# Altium schematic sheet 07 - ETH0-1000.SchDoc
size B; CompanyName: Microchip Technology Inc.; Organization: Microchip Technology; Address1: 2355 West Chandler Blvd.; Address2: Chandler, AZ  85224; Address4: USA; SheetNumber: 8; SheetTotal: 15; SheetTitle: ETH0-1000; Time: Time
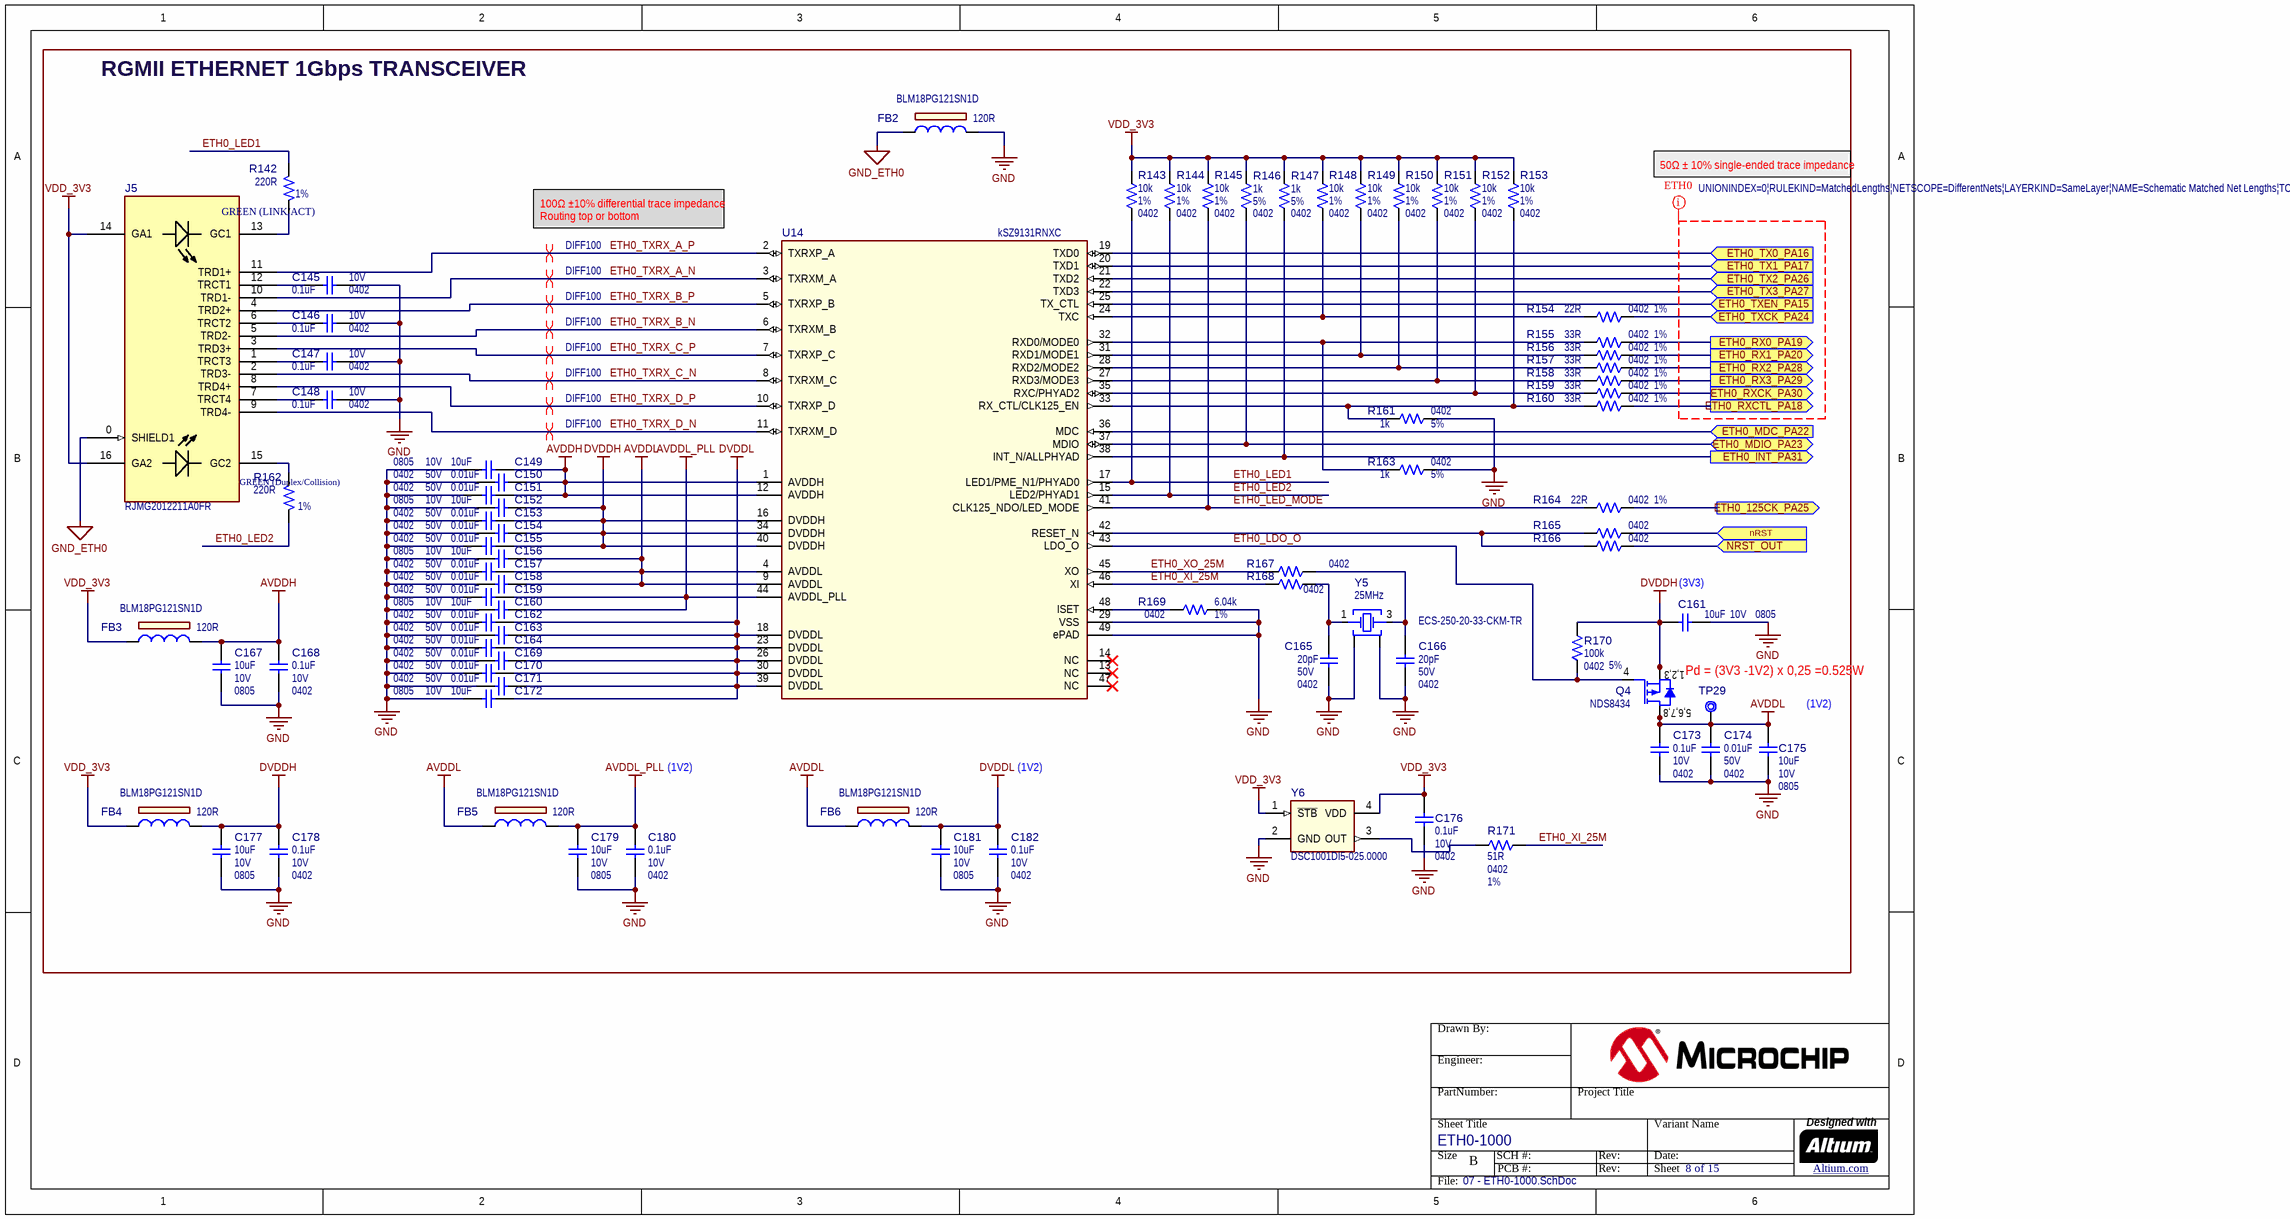
[diagram p0: 07 - ETH0-1000.SchDoc]

## Parts
?  (no value)  (graphical)
C145  value 0.1uF  Voltage: 10V  Package: 0402  [CAP_C_0402]  (hidden comment: Capacitor NP)
C146  value 0.1uF  Voltage: 10V  Package: 0402  [CAP_C_0402]  (hidden comment: Capacitor NP)
C147  value 0.1uF  Voltage: 10V  Package: 0402  [CAP_C_0402]  (hidden comment: Capacitor NP)
C148  value 0.1uF  Voltage: 10V  Package: 0402  [CAP_C_0402]  (hidden comment: Capacitor NP)
C149  value 10uF  Voltage: 10V  Package: 0805  [CAP_C_0805]  (hidden comment: Capacitor NP)
C150  value 0.01uF  Voltage: 50V  Package: 0402  [CAP_C_0402]  (hidden comment: Capacitor NP)
C151  value 0.01uF  Voltage: 50V  Package: 0402  [CAP_C_0402]  (hidden comment: Capacitor NP)
C152  value 10uF  Voltage: 10V  Package: 0805  [CAP_C_0805]  (hidden comment: Capacitor NP)
C153  value 0.01uF  Voltage: 50V  Package: 0402  [CAP_C_0402]  (hidden comment: Capacitor NP)
C154  value 0.01uF  Voltage: 50V  Package: 0402  [CAP_C_0402]  (hidden comment: Capacitor NP)
C155  value 0.01uF  Voltage: 50V  Package: 0402  [CAP_C_0402]  (hidden comment: Capacitor NP)
C156  value 10uF  Voltage: 10V  Package: 0805  [CAP_C_0805]  (hidden comment: Capacitor NP)
C157  value 0.01uF  Voltage: 50V  Package: 0402  [CAP_C_0402]  (hidden comment: Capacitor NP)
C158  value 0.01uF  Voltage: 50V  Package: 0402  [CAP_C_0402]  (hidden comment: Capacitor NP)
C159  value 0.01uF  Voltage: 50V  Package: 0402  [CAP_C_0402]  (hidden comment: Capacitor NP)
C160  value 10uF  Voltage: 10V  Package: 0805  [CAP_C_0805]  (hidden comment: Capacitor NP)
C161  value 10uF  Voltage: 10V  Package: 0805  [CAP_C_0805]  (hidden comment: Capacitor NP)
C162  value 0.01uF  Voltage: 50V  Package: 0402  [CAP_C_0402]  (hidden comment: Capacitor NP)
C163  value 0.01uF  Voltage: 50V  Package: 0402  [CAP_C_0402]  (hidden comment: Capacitor NP)
C164  value 0.01uF  Voltage: 50V  Package: 0402  [CAP_C_0402]  (hidden comment: Capacitor NP)
C165  value 20pF  Voltage: 50V  Package: 0402  [CAP_C_0402]  (hidden comment: Capacitor NP)
C166  value 20pF  Voltage: 50V  Package: 0402  [CAP_C_0402]  (hidden comment: Capacitor NP)
C167  value 10uF  Voltage: 10V  Package: 0805  [CAP_C_0805]  (hidden comment: Capacitor NP)
C168  value 0.1uF  Voltage: 10V  Package: 0402  [CAP_C_0402]  (hidden comment: Capacitor NP)
C169  value 0.01uF  Voltage: 50V  Package: 0402  [CAP_C_0402]  (hidden comment: Capacitor NP)
C170  value 0.01uF  Voltage: 50V  Package: 0402  [CAP_C_0402]  (hidden comment: Capacitor NP)
C171  value 0.01uF  Voltage: 50V  Package: 0402  [CAP_C_0402]  (hidden comment: Capacitor NP)
C172  value 10uF  Voltage: 10V  Package: 0805  [CAP_C_0805]  (hidden comment: Capacitor NP)
C173  value 0.1uF  Voltage: 10V  Package: 0402  [CAP_C_0402]  (hidden comment: Capacitor NP)
C174  value 0.01uF  Voltage: 50V  Package: 0402  [CAP_C_0402]  (hidden comment: Capacitor NP)
C175  value 10uF  Voltage: 10V  Package: 0805  [CAP_C_0805]  (hidden comment: Capacitor NP)
C176  value 0.1uF  Voltage: 10V  Package: 0402  [CAP_C_0402]  (hidden comment: Capacitor NP)
C177  value 10uF  Voltage: 10V  Package: 0805  [CAP_C_0805]  (hidden comment: Capacitor NP)
C178  value 0.1uF  Voltage: 10V  Package: 0402  [CAP_C_0402]  (hidden comment: Capacitor NP)
C179  value 10uF  Voltage: 10V  Package: 0805  [CAP_C_0805]  (hidden comment: Capacitor NP)
C180  value 0.1uF  Voltage: 10V  Package: 0402  [CAP_C_0402]  (hidden comment: Capacitor NP)
C181  value 10uF  Voltage: 10V  Package: 0805  [CAP_C_0805]  (hidden comment: Capacitor NP)
C182  value 0.1uF  Voltage: 10V  Package: 0402  [CAP_C_0402]  (hidden comment: Capacitor NP)
FB2  value 120R  Manufacturer Part Number 1: BLM18PG121SN1D  [IND_C_0603]  (hidden comment: Ferrite Bead)
FB3  value 120R  Manufacturer Part Number 1: BLM18PG121SN1D  [IND_C_0603]  (hidden comment: Ferrite Bead)
FB4  value 120R  Manufacturer Part Number 1: BLM18PG121SN1D  [IND_C_0603]  (hidden comment: Ferrite Bead)
FB5  value 120R  Manufacturer Part Number 1: BLM18PG121SN1D  [IND_C_0603]  (hidden comment: Ferrite Bead)
FB6  value 120R  Manufacturer Part Number 1: BLM18PG121SN1D  [IND_C_0603]  (hidden comment: Ferrite Bead)
J5  Manufacturer Part Number 1: RJMG2012211A0FR  [CON_JACK_RJ45_1PORT_LED_RJMG2012211A0FR]  (hidden comment: CON RJ-45 RJMG2012211A0FR)
Q4  value NDS8434  [SOIC-8]  (hidden comment: Transistor MOS-P SSSGDDDD)
R142  value 220R  Tolerance: 1%  [RES_C_0603]  (hidden comment: Resistor)
R143  value 10k  Package: 0402  Tolerance: 1%  [RES_C_0402]  (hidden comment: Resistor)
R144  value 10k  Package: 0402  Tolerance: 1%  [RES_C_0402]  (hidden comment: Resistor)
R145  value 10k  Package: 0402  Tolerance: 1%  [RES_C_0402]  (hidden comment: Resistor)
R146  value 1k  Package: 0402  Tolerance: 5%  [RES_C_0402]  (hidden comment: Resistor)
R147  value 1k  Package: 0402  Tolerance: 5%  [RES_C_0402]  (hidden comment: Resistor)
R148  value 10k  Package: 0402  Tolerance: 1%  [RES_C_0402]  (hidden comment: Resistor)
R149  value 10k  Package: 0402  Tolerance: 1%  [RES_C_0402]  (hidden comment: Resistor)
R150  value 10k  Package: 0402  Tolerance: 1%  [RES_C_0402]  (hidden comment: Resistor)
R151  value 10k  Package: 0402  Tolerance: 1%  [RES_C_0402]  (hidden comment: Resistor)
R152  value 10k  Package: 0402  Tolerance: 1%  [RES_C_0402]  (hidden comment: Resistor)
R153  value 10k  Package: 0402  Tolerance: 1%  [RES_C_0402]  (hidden comment: Resistor)
R154  value 22R  Package: 0402  Tolerance: 1%  [RES_C_0402]  (hidden comment: Resistor)
R155  value 33R  Package: 0402  Tolerance: 1%  [RES_C_0402]  (hidden comment: Resistor)
R156  value 33R  Package: 0402  Tolerance: 1%  [RES_C_0402]  (hidden comment: Resistor)
R157  value 33R  Package: 0402  Tolerance: 1%  [RES_C_0402]  (hidden comment: Resistor)
R158  value 33R  Package: 0402  Tolerance: 1%  [RES_C_0402]  (hidden comment: Resistor)
R159  value 33R  Package: 0402  Tolerance: 1%  [RES_C_0402]  (hidden comment: Resistor)
R160  value 33R  Package: 0402  Tolerance: 1%  [RES_C_0402]  (hidden comment: Resistor)
R161  value 1k  Package: 0402  Tolerance: 5%  [RES_C_0402]  (hidden comment: Resistor)
R162  value 220R  Tolerance: 1%  [RES_C_0603]  (hidden comment: Resistor)
R163  value 1k  Package: 0402  Tolerance: 5%  [RES_C_0402]  (hidden comment: Resistor)
R164  value 22R  Package: 0402  Tolerance: 1%  [RES_C_0402]  (hidden comment: Resistor)
R165  Package: 0402  [RES_C_0402]  (hidden comment: Resistor)
R166  Package: 0402  [RES_C_0402]  (hidden comment: Resistor)
R167  Package: 0402  [RES_C_0402]  (hidden comment: Resistor)
R168  Package: 0402  [RES_C_0402]  (hidden comment: Resistor)
R169  value 6.04k  Package: 0402  Tolerance: 1%  [RES_C_0402]  (hidden comment: Resistor)
R170  value 100k  Package: 0402  Tolerance: 5%  [RES_C_0402]  (hidden comment: Resistor)
R171  value 51R  Package: 0402  Tolerance: 1%  [RES_C_0402]  (hidden comment: Resistor)
TP29  Test Point No BOM  [TP_1mm_SMD]  (value not drawn)  (no BOM)
U14  Manufacturer Part Number 1: kSZ9131RNXC  [QFN-48_7x7_EP5.1x5.1]  (hidden comment: KSZ9131RNX QFN-48)
Y5  value 25MHz  Manufacturer Part Number 1: ECS-250-20-33-CKM-TR  [CRYSTAL_L3.2W2.5H0.8]  (hidden comment: Crystal 4 pins 1-3)
Y6  Manufacturer Part Number 1: DSC1001DI5-025.0000  [DFN-4_2.5x2]  (hidden comment: DSC10xx DFN-4)

## Blocks framed on the sheet
RGMII ETHERNET 1Gbps TRANSCEIVER: C145-C182 FB2-FB6 J5 Q4 R142-R171 TP29 U14 Y5 Y6

## Ports
ETH0_125CK_PA25 (out), ETH0_INT_PA31 (out), ETH0_MDC_PA22 (in), ETH0_MDIO_PA23 (bidir), ETH0_RX0_PA19 (out), ETH0_RX1_PA20 (out), ETH0_RX2_PA28 (out), ETH0_RX3_PA29 (out), ETH0_RXCK_PA30 (out), ETH0_RXCTL_PA18 (out), ETH0_TX0_PA16 (in), ETH0_TX1_PA17 (in), ETH0_TX2_PA26 (in), ETH0_TX3_PA27 (in), ETH0_TXCK_PA24 (in), ETH0_TXEN_PA15 (in), nRST (in), NRST_OUT (in)

## Nets
AVDDH: C149.1 C150.1 C151.1 C167.2 C168.2 FB3.2 U14.1(AVDDH) U14.12(AVDDH)
AVDDL: C156.1 C157.1 C158.1 C173.2 C174.2 C175.2 FB5.1 FB6.1 Q4.5(D) Q4.6(D) Q4.7(D) Q4.8(D) TP29.1 U14.4(AVDDL) U14.9(AVDDL)
AVDDL_PLL: C159.1 C160.1 C179.2 C180.2 FB5.2 U14.44(AVDDL_PLL)
DVDDH: C152.1 C153.1 C154.1 C155.1 C161.2 C177.2 C178.2 FB4.2 Q4.1(S) Q4.2(S) Q4.3(S) R170.2 U14.16(DVDDH) U14.34(DVDDH) U14.40(DVDDH)
DVDDL: C162.1 C163.1 C164.1 C169.1 C170.1 C171.1 C172.1 C181.2 C182.2 FB6.2 U14.18(DVDDL) U14.23(DVDDL) U14.26(DVDDL) U14.30(DVDDL) U14.39(DVDDL)
GND: C145.1 C146.1 C147.1 C148.1 C149.2 C150.2 C151.2 C152.2 C153.2 C154.2 C155.2 C156.2 C157.2 C158.2 C159.2 C160.2 C161.1 C162.2 C163.2 C164.2 C165.2 C166.2 C167.1 C168.1 C169.2 C170.2 C171.2 C172.2 C173.1 C174.1 C175.1 C176.1 C177.1 C178.1 C179.1 C180.1 C181.1 C182.1 FB2.2 R161.2 R163.2 R169.2 U14.29(VSS) U14.49(ePAD) Y5.2 Y5.4 Y6.2(GND)
GND_ETH0: FB2.1 J5.0(SHIELD1)
VDD_3V3: C176.2 FB3.1 FB4.1 J5.14(GA1) J5.16(GA2) R143.2 R144.2 R145.2 R146.2 R147.2 R148.2 R149.2 R150.2 R151.2 R152.2 R153.2 Y6.1(~{STB}) Y6.4(VDD)
ETH0_125CK_PA25: R164.2 ; port ETH0_125CK_PA25
ETH0_INT_PA31: R147.1 U14.38(INT_N/ALLPHYAD) ; port ETH0_INT_PA31
ETH0_LDO_O: Q4.4(G) R170.1 U14.43(LDO_O)
ETH0_LED1: R142.2 R143.1 U14.17(LED1/PME_N1/PHYAD0)
ETH0_LED2: R144.1 R162.2 U14.15(LED2/PHYAD1)
ETH0_LED_MODE: R145.1 R164.1 U14.41(CLK125_NDO/LED_MODE)
ETH0_MDC_PA22: U14.36(MDC) ; port ETH0_MDC_PA22
ETH0_MDIO_PA23: R146.1 U14.37(MDIO) ; port ETH0_MDIO_PA23
ETH0_RX0_PA19: R155.2 ; port ETH0_RX0_PA19
ETH0_RX1_PA20: R156.2 ; port ETH0_RX1_PA20
ETH0_RX2_PA28: R157.2 ; port ETH0_RX2_PA28
ETH0_RX3_PA29: R158.2 ; port ETH0_RX3_PA29
ETH0_RXCK_PA30: R159.2 ; port ETH0_RXCK_PA30
ETH0_RXCTL_PA18: R160.2 ; port ETH0_RXCTL_PA18
ETH0_TX0_PA16: U14.19(TXD0) ; port ETH0_TX0_PA16
ETH0_TX1_PA17: U14.20(TXD1) ; port ETH0_TX1_PA17
ETH0_TX2_PA26: U14.21(TXD2) ; port ETH0_TX2_PA26
ETH0_TX3_PA27: U14.22(TXD3) ; port ETH0_TX3_PA27
ETH0_TXCK_PA24: R154.2 ; port ETH0_TXCK_PA24
ETH0_TXEN_PA15: U14.25(TX_CTL) ; port ETH0_TXEN_PA15
ETH0_TXRX_A_N: J5.10(TRD1-) U14.3(TXRXM_A)
ETH0_TXRX_A_P: J5.11(TRD1+) U14.2(TXRXP_A)
ETH0_TXRX_B_N: J5.5(TRD2-) U14.6(TXRXM_B)
ETH0_TXRX_B_P: J5.4(TRD2+) U14.5(TXRXP_B)
ETH0_TXRX_C_N: J5.2(TRD3-) U14.8(TXRXM_C)
ETH0_TXRX_C_P: J5.3(TRD3+) U14.7(TXRXP_C)
ETH0_TXRX_D_N: J5.9(TRD4-) U14.11(TXRXM_D)
ETH0_TXRX_D_P: J5.8(TRD4+) U14.10(TXRXP_D)
ETH0_XI_25M: R168.2 R171.1 U14.46(XI)
ETH0_XO_25M: R167.2 U14.45(XO)
nRST: R165.1 ; port nRST
NRST_OUT: R166.1 ; port NRST_OUT
NetC145_2: C145.2 J5.12(TRCT1)
NetC146_2: C146.2 J5.6(TRCT2)
NetC147_2: C147.2 J5.1(TRCT3)
NetC148_2: C148.2 J5.7(TRCT4)
NetC165_1: C165.1 R168.1 Y5.1
NetC166_1: C166.1 R167.1 Y5.3
NetJ5_13: J5.13(GC1) R142.1
NetJ5_15: J5.15(GC2) R162.1
NetR148_1: R148.1 R154.1 U14.24(TXC)
NetR149_1: R149.1 R156.1 U14.31(RXD1/MODE1)
NetR150_1: R150.1 R157.1 U14.28(RXD2/MODE2)
NetR151_1: R151.1 R158.1 U14.27(RXD3/MODE3)
NetR152_1: R152.1 R159.1 U14.35(RXC/PHYAD2)
NetR153_1: R153.1 R160.1 R161.1 U14.33(RX_CTL/CLK125_EN)
NetR155_1: R155.1 R163.1 U14.32(RXD0/MODE0)
NetR165_2: R165.2 R166.2 U14.42(RESET_N)
NetR169_1: R169.1 U14.48(ISET)
NetR171_2: R171.2 Y6.3(OUT)

Not connected (* = marked no-connect by the designer): U14 13(NC)* 14(NC)* 47(NC)*

## Layout directives
net class ETH0; rule Matched Net Lengths [Tolerance = 0.25mm]: (no net found under the mark)
differential pair; differential pair class DIFF100; net class DIFF100; rule Matched Net Lengths [Tolerance = 4mil]: ETH0_TXRX_A_N, ETH0_TXRX_A_P, ETH0_TXRX_B_N, ETH0_TXRX_B_P, ETH0_TXRX_C_N, ETH0_TXRX_C_P, ETH0_TXRX_D_N, ETH0_TXRX_D_P

## Notes on the sheet
- 100Ω ±10% differential trace impedance
  Routing top or bottom
- 50Ω ± 10% single-ended trace impedance
- (near C161) (3V3)
- Pd = (3V3 -1V2) x 0,25 =0.525W
- (near C175) (1V2)
- (1V2)
- Drawn By:
- Engineer:
- PartNumber:
- Project Title
- Sheet Title
- Size
- B
- SCH #:
- PCB #:
- Rev:
- Variant Name
- Date:
- Sheet
- Designed with
- Altium.com <http://go.altium.com/MicrochipLandingPage_Evaluation.html>
- File:
- (in symbol CON1827) GREEN (LINK/ACT); GREEN (Duplex/Collision)
- (in symbol TRA1217) 1,2,3; 5,6,7,8

## Library data of the parts
? = Title Block B
C145-C148 C168 C173 C176 C178 C180 C182 = CAP1238: Capacitor; Manufacturer 1: KEMET; Manufacturer Part Number 1: C0402C104K8RACTU; Description_: CAP CER 0.1uF 10V 10% X7R SMD 0402; Dev Tools Status: Production; Tolerance: 10%; Temperature Coeffcient: X7R; Type: Ceramic; Owner: Tad Ahlvers; Populated: YES; MCHP-ID: CAP1238; Revision: 1; Symbol: Capacitor NP; Status: MCL Design; ComponentLink1URL: https://chn-vm-apps.microchip.com/mchprepo/parts/Datasheets/KEM_C1002_X7R_SMD.pdf; ComponentLink1Description: SVN Datasheet; ComponentLink2URL: C:\ALTIUM_WORK\00001_MCHP-CDB\Datasheets\KEM_C1002_X7R_SMD.pdf; ComponentLink2Description: Local Datasheet; ComponentLink3URL: C:\ALTIUM_WORK\00001_MCHP-CDB\Library\LibraryRefs\Capacitor NP.SchLib; ComponentLink3Description: Open Symbol; ComponentLink4URL: C:\ALTIUM_WORK\00001_MCHP-CDB\Library\Footprints\CAP_C_0402.PcbLib; ComponentLink4Description: Open Footprint; ComponentLink5Description: Open Footprint 2; ComponentLink6Description: Open Footprint 3; ComponentLink7Description: Open Footprint 4; Operating Temperature: -55C to +125C; Category: Capacitor; Manufacturer 2: Samsung; Manufacturer Part Number 2: CL05B104KP5NNNC; Manufacturer 3: Murata Electronics; Manufacturer Part Number 3: GRM155R71A104KA01D; Supplier 1: Digi-Key; Supplier Part Number 1: 399-3520-2-ND; Supplier 2: Digi-Key; Supplier Part Number 2: 1276-1002-2-ND; Supplier 3: Mouser; Supplier Part Number 3: 81-GRM155R71A104KA1D; Quantity Override: 1
C149 C152 C156 C160 C161 C172 C175 C179 C181 = CAP1148: Capacitor; Manufacturer 1: Samsung Electro-Mechanics America, Inc; Manufacturer Part Number 1: CL21B106KPQNFNE; Description_: CAP CER 10uF 10V 10% X7R SMD 0805; Dev Tools Status: Production; Tolerance: 10%; Temperature Coeffcient: X7R; Type: Ceramic; Owner: Mihai T(M91442); Populated: Yes; MCHP-ID: CAP1148; Revision: 0; Symbol: Capacitor NP; Status: MCL Design; ComponentLink1URL: https://chn-vm-apps.microchip.com/mchprepo/parts/Datasheets/L0005E.pdf; ComponentLink1Description: SVN Datasheet; ComponentLink2URL: C:\ALTIUM_WORK\00001_MCHP-CDB\Datasheets\L0005E.pdf; ComponentLink2Description: Local Datasheet; ComponentLink3URL: C:\ALTIUM_WORK\00001_MCHP-CDB\Library\LibraryRefs\Capacitor NP.SchLib; ComponentLink3Description: Open Symbol; ComponentLink4URL: C:\ALTIUM_WORK\00001_MCHP-CDB\Library\Footprints\CAP_C_0805.PcbLib; ComponentLink4Description: Open Footprint; ComponentLink5Description: Open Footprint 2; ComponentLink6Description: Open Footprint 3; ComponentLink7Description: Open Footprint 4; Operating Temperature: -55C to +125C; Category: Capacitor; Manufacturer 2: TDK Corporation; Manufacturer Part Number 2: C2012X7R1A106K125AC; Manufacturer 3: Murata; Manufacturer Part Number 3: GRM21BR71A106KE51L; Supplier 1: Digi-Key; Supplier Part Number 1: 1276-2934-1-ND; Supplier 2: Digi-Key; Supplier Part Number 2: 445-6857-1-ND; Supplier 3: Digi-Key; Supplier Part Number 3: 490-3905-1-ND; Supplier 4: Farnell; Supplier Part Number 4: 1828828; Quantity Override: 1
C150 C151 C153-C155 C157-C159 C162-C164 C169-C171 C174 = CAP2026: Capacitor; Manufacturer 1: TDK Corporation; Manufacturer Part Number 1: CGA2B3X7R1H103K050BB; Description_: CAP CER 0.01uF 50V 10% X7R SMD 0402; Dev Tools Status: Design; Tolerance: 10%; Temperature Coeffcient: X7R; Type: Ceramic; Owner: Gabor Bihari; Populated: YES; MCHP-ID: CAP2026; Revision: A; Symbol: Capacitor NP; Status: MCL Design; ComponentLink1URL: https://chn-vm-apps.microchip.com/mchprepo/parts/Datasheets/mlcc_automotive_general_en.pdf; ComponentLink1Description: SVN Datasheet; ComponentLink2URL: C:\ALTIUM_WORK\00001_MCHP-CDB\Datasheets\mlcc_automotive_general_en.pdf; ComponentLink2Description: Local Datasheet; ComponentLink3URL: C:\ALTIUM_WORK\00001_MCHP-CDB\Library\LibraryRefs\Capacitor NP.SchLib; ComponentLink3Description: Open Symbol; ComponentLink4URL: C:\ALTIUM_WORK\00001_MCHP-CDB\Library\Footprints\CAP_C_0402.PcbLib; ComponentLink4Description: Open Footprint; ComponentLink5Description: Open Footprint 2; ComponentLink6Description: Open Footprint 3; ComponentLink7Description: Open Footprint 4; Operating Temperature: -55C to +125C; Category: Capacitor; Supplier 1: Digi-Key; Supplier Part Number 1: 445-6893-1-ND; Quantity Override: 1
C165 C166 = CAP2438: Manufacturer 1: Samsung Electro-Mechanics; Manufacturer Part Number 1: CL05C200GB51PNC; Description_: Ceramic capacitor, SMD 0402, 20pF, C0G, 50V, +/-2%; Dev Tools Status: Design; Tolerance: 2%; Temperature Coeffcient: C0G; Type: Ceramic; Populated: DNP; Owner: Dragos Danaila; MCHP-ID: CAP2438; Revision: 1; Symbol: Capacitor NP; Status: MCL Design; ComponentLink1Description: SVN Datasheet; ComponentLink2Description: Local Datasheet; ComponentLink3URL: C:\ALTIUM_WORK\00001_MCHP-CDB\Library\LibraryRefs\Capacitor NP.SchLib; ComponentLink3Description: Open Symbol; ComponentLink4URL: C:\ALTIUM_WORK\00001_MCHP-CDB\Library\Footprints\CAP_C_0402.PcbLib; ComponentLink4Description: Open Footprint; ComponentLink5Description: Open Footprint 2; ComponentLink6Description: Open Footprint 3; ComponentLink7Description: Open Footprint 4; Operating Temperature: -55C to +125C; Category: Capacitor; Supplier 1: Digikey; Supplier Part Number 1: 1276-CL05C200GB51PNCTR-ND; Quantity Override: 1
C167 C177 = CAP1148: Capacitor; Manufacturer 1: Samsung Electro-Mechanics America, Inc; Manufacturer Part Number 1: CL21B106KPQNFNE; Description_: CAP CER 10uF 10V 10% X7R SMD 0805; Dev Tools Status: Production; Tolerance: 10%; Temperature Coeffcient: X7R; Type: Ceramic; Owner: Mihai T(M91442); Populated: DNP; MCHP-ID: CAP1148; Revision: 0; Symbol: Capacitor NP; Status: MCL Design; ComponentLink1URL: https://chn-vm-apps.microchip.com/mchprepo/parts/Datasheets/L0005E.pdf; ComponentLink1Description: SVN Datasheet; ComponentLink2URL: C:\ALTIUM_WORK\00001_MCHP-CDB\Datasheets\L0005E.pdf; ComponentLink2Description: Local Datasheet; ComponentLink3URL: C:\ALTIUM_WORK\00001_MCHP-CDB\Library\LibraryRefs\Capacitor NP.SchLib; ComponentLink3Description: Open Symbol; ComponentLink4URL: C:\ALTIUM_WORK\00001_MCHP-CDB\Library\Footprints\CAP_C_0805.PcbLib; ComponentLink4Description: Open Footprint; ComponentLink5Description: Open Footprint 2; ComponentLink6Description: Open Footprint 3; ComponentLink7Description: Open Footprint 4; Operating Temperature: -55C to +125C; Category: Capacitor; Manufacturer 2: TDK Corporation; Manufacturer Part Number 2: C2012X7R1A106K125AC; Manufacturer 3: Murata; Manufacturer Part Number 3: GRM21BR71A106KE51L; Supplier 1: Digi-Key; Supplier Part Number 1: 1276-2934-1-ND; Supplier 2: Digi-Key; Supplier Part Number 2: 445-6857-1-ND; Supplier 3: Digi-Key; Supplier Part Number 3: 490-3905-1-ND; Supplier 4: Farnell; Supplier Part Number 4: 1828828; Quantity Override: 1
FB2-FB6 = IND1009: Manufacturer 1: Murata; Description_: FERRITE 120R@100MHz 2A SMD 0603; Dev Tools Status: Production; Owner: Petnarong Chaijaroong; DCR: 0.05R; Saturation Current: 12A; Populated: Yes; MCHP-ID: IND1009; Revision: 0; Symbol: Ferrite Bead; Status: MCL Design; ComponentLink1URL: https://chn-vm-apps.microchip.com/mchprepo/parts/Datasheets/L0110S0100BLM18P.pdf; ComponentLink1Description: SVN Datasheet; ComponentLink2URL: C:\ALTIUM_WORK\00001_MCHP-CDB\Datasheets\L0110S0100BLM18P.pdf; ComponentLink2Description: Local Datasheet; ComponentLink3URL: C:\ALTIUM_WORK\00001_MCHP-CDB\Library\LibraryRefs\Ferrite Bead.SchLib; ComponentLink3Description: Open Symbol; ComponentLink4URL: C:\ALTIUM_WORK\00001_MCHP-CDB\Library\Footprints\IND_C_0603.PcbLib; ComponentLink4Description: Open Footprint; ComponentLink5Description: Open Footprint 2; ComponentLink6Description: Open Footprint 3; ComponentLink7Description: Open Footprint 4; Operating Temperature: -55C to +125C; Package: 0603; Type: Ferrite Bead; Category: Inductor; Supplier 1: Digi-Key; Supplier Part Number 1: 490-1037-1-ND; Quantity Override: 1
J5 = CON1827: Manufacturer 1: Amphenol Commercial Products; Value: MODULAR RJ45; Description_: CON MODULAR JACK RJ45 10/100/1000 MAGNETICS 2xLEDs SHIELD TH R/A; Dev Tools Status: Production; Owner: Jennifer Hancock; Populated: YES; MCHP-ID: CON1827; Revision: 1; Symbol: CON RJ-45 RJMG2012211A0FR; Status: MCL Design; ComponentLink1URL: https://chn-vm-apps.microchip.com/mchprepo/parts/Datasheets/RJMG2012211A0FR-RJ45MagjackwLED; ComponentLink1Description: SVN Datasheet; ComponentLink2URL: C:\ALTIUM_WORK\00001_MCHP-CDB\Datasheets\RJMG2012211A0FR-RJ45MagjackwLED; ComponentLink2Description: Local Datasheet; ComponentLink3URL: C:\ALTIUM_WORK\00001_MCHP-CDB\Library\LibraryRefs\CON RJ-45 RJMG2012211A0FR.SchLib; ComponentLink3Description: Open Symbol; ComponentLink4URL: C:\ALTIUM_WORK\00001_MCHP-CDB\Library\Footprints\CON_JACK_RJ45_1PORT_LED_RJMG2012211A0FR.PcbLib; ComponentLink4Description: Open Footprint; ComponentLink5Description: Open Footprint 2; ComponentLink6Description: Open Footprint 3; ComponentLink7Description: Open Footprint 4; Type: Modular; Category: Connector; Supplier 1: Digi-Key; Supplier Part Number 1: RJMG2012211A0FR-ND; Quantity Override: 1
Q4 = TRA1217: Transistor MOS; Manufacturer 1: ON Semiconductor; Description_: TRANS FET P-CH NDS8434 20V 6.5A 2.5W SOIC-8; Dev Tools Status: Design; Type: FET; Current: 6.5A; Drain to Source Voltage: 20V; Gate to Source Voltage: 8V; Power: 2.5W; Owner: Cristian Papuc; Populated: YES; MCHP-ID: TRA1217; Revision: A; Symbol: Transistor MOS-P SSSGDDDD; Status: MCL Design; Package: SOIC-8; ComponentLink1URL: https://chn-vm-apps.microchip.com/mchprepo/parts/Datasheets/NDS8425.pdf; ComponentLink1Description: SVN Datasheet; ComponentLink2URL: C:\ALTIUM_WORK\00001_MCHP-CDB\Datasheets\NDS8425.pdf; ComponentLink2Description: Local Datasheet; ComponentLink3URL: C:\ALTIUM_WORK\00001_MCHP-CDB\Library\LibraryRefs\Transistor MOS-P SSSGDDDD.SchLib; ComponentLink3Description: Open Symbol; ComponentLink4URL: C:\ALTIUM_WORK\00001_MCHP-CDB\Library\Footprints\SOIC-8.PcbLib; ComponentLink4Description: Open Footprint; ComponentLink5Description: Open Footprint 2; ComponentLink6Description: Open Footprint 3; ComponentLink7Description: Open Footprint 4; Operating Temperature: -55C to +150C; Category: Transistor; Voltage: 20V; Manufacturer Part Number 1: NDS8434; Supplier 1: Digi-Key; Supplier Part Number 1: NDS8434CT-ND; Quantity Override: 1
R142 R162 = RSMT1296: Manufacturer 1: Stackpole Electronics Inc; Manufacturer Part Number 1: RMCF0603FT220R; Description_: RES TKF 220R 1% 1/10W SMD 0603; Dev Tools Status: Design; Voltage: 75V; Temperature Coeffcient: 100ppm/C; Power: 1/10W; Owner: Dragos Danaila; Populated: YES; MCHP-ID: RSMT1296; Revision: 1; Symbol: Resistor; Status: MCL Design; ComponentLink1URL: https://chn-vm-apps.microchip.com/mchprepo/parts/Datasheets/sei-rmcf_rmcp.pdf; ComponentLink1Description: SVN Datasheet; ComponentLink2URL: C:\ALTIUM_WORK\00001_MCHP-CDB\Datasheets\sei-rmcf_rmcp.pdf; ComponentLink2Description: Local Datasheet; ComponentLink3URL: C:\ALTIUM_WORK\00001_MCHP-CDB\Library\LibraryRefs\Resistor.SchLib; ComponentLink3Description: Open Symbol; ComponentLink4URL: C:\ALTIUM_WORK\00001_MCHP-CDB\Library\Footprints\RES_C_0603.PcbLib; ComponentLink4Description: Open Footprint; ComponentLink5Description: Open Footprint 2; ComponentLink6Description: Open Footprint 3; ComponentLink7Description: Open Footprint 4; Operating Temperature: -55C to +155C; Category: Resistor; Type: RES SMD; Composition: TKF; Supplier 1: Digikey; Supplier Part Number 1: RMCF0603FT220RCT-ND; Quantity Override: 1
R143-R145 R149-R152 = RSMT1019: Manufacturer 1: Panasonic; Manufacturer Part Number 1: ERJ-2RKF1002X; Description_: RES TKF 10k 1% 1/10W SMD 0402; Dev Tools Status: Production; Voltage: 50V; Temperature Coeffcient: 100ppm/C; Power: 1/10W; Owner: Brent Lanphear; Populated: Yes; MCHP-ID: RSMT1019; Revision: 2; Symbol: Resistor; Status: MCL Design; ComponentLink1URL: https://chn-vm-apps.microchip.com/mchprepo/parts/Datasheets/AOA0000CE2.pdf; ComponentLink1Description: SVN Datasheet; ComponentLink2URL: C:\ALTIUM_WORK\00001_MCHP-CDB\Datasheets\AOA0000CE2.pdf; ComponentLink2Description: Local Datasheet; ComponentLink3URL: C:\ALTIUM_WORK\00001_MCHP-CDB\Library\LibraryRefs\Resistor.SchLib; ComponentLink3Description: Open Symbol; ComponentLink4URL: C:\ALTIUM_WORK\00001_MCHP-CDB\Library\Footprints\RES_C_0402.PcbLib; ComponentLink4Description: Open Footprint; ComponentLink5Description: Open Footprint 2; ComponentLink6Description: Open Footprint 3; ComponentLink7Description: Open Footprint 4; Operating Temperature: -55C to +155C; Category: Resistor; Type: RES SMD; Composition: TKF; Supplier 1: Digi-Key; Supplier Part Number 1: P10.0KLCT-ND; Quantity Override: 1
R146 R147 R161 R163 = RSMT0316: Manufacturer 1: Panasonic; Manufacturer Part Number 1: ERJ-2GEJ102X; Description_: RES TKF 1k 5% 1/16W SMD 0402; Dev Tools Status: Production; Voltage: 50V; Temperature Coeffcient: 200ppm/C; Power: 1/16W; Owner: Tad Ahlvers; Populated: YES; MCHP-ID: RSMT0316; Revision: 1; Symbol: Resistor; Status: MCL Design; ComponentLink1URL: https://chn-vm-apps.microchip.com/mchprepo/parts/Datasheets/AOA0000CE1.pdf; ComponentLink1Description: SVN Datasheet; ComponentLink2URL: C:\ALTIUM_WORK\00001_MCHP-CDB\Datasheets\AOA0000CE1.pdf; ComponentLink2Description: Local Datasheet; ComponentLink3URL: C:\ALTIUM_WORK\00001_MCHP-CDB\Library\LibraryRefs\Resistor.SchLib; ComponentLink3Description: Open Symbol; ComponentLink4URL: C:\ALTIUM_WORK\00001_MCHP-CDB\Library\Footprints\RES_C_0402.PcbLib; ComponentLink4Description: Open Footprint; ComponentLink5Description: Open Footprint 2; ComponentLink6Description: Open Footprint 3; ComponentLink7Description: Open Footprint 4; Operating Temperature: -55C to +155C; Category: Resistor; Type: RES SMD; Composition: TKF; Supplier 1: Digi-Key; Supplier Part Number 1: P1.0KJCT-ND; Quantity Override: 1
R148 R153 = RSMT1019: Manufacturer 1: Panasonic; Manufacturer Part Number 1: ERJ-2RKF1002X; Description_: RES TKF 10k 1% 1/10W SMD 0402; Dev Tools Status: Production; Voltage: 50V; Temperature Coeffcient: 100ppm/C; Power: 1/10W; Owner: Brent Lanphear; Populated: DNP; MCHP-ID: RSMT1019; Revision: 2; Symbol: Resistor; Status: MCL Design; ComponentLink1URL: https://chn-vm-apps.microchip.com/mchprepo/parts/Datasheets/AOA0000CE2.pdf; ComponentLink1Description: SVN Datasheet; ComponentLink2URL: C:\ALTIUM_WORK\00001_MCHP-CDB\Datasheets\AOA0000CE2.pdf; ComponentLink2Description: Local Datasheet; ComponentLink3URL: C:\ALTIUM_WORK\00001_MCHP-CDB\Library\LibraryRefs\Resistor.SchLib; ComponentLink3Description: Open Symbol; ComponentLink4URL: C:\ALTIUM_WORK\00001_MCHP-CDB\Library\Footprints\RES_C_0402.PcbLib; ComponentLink4Description: Open Footprint; ComponentLink5Description: Open Footprint 2; ComponentLink6Description: Open Footprint 3; ComponentLink7Description: Open Footprint 4; Operating Temperature: -55C to +155C; Category: Resistor; Type: RES SMD; Composition: TKF; Supplier 1: Digi-Key; Supplier Part Number 1: P10.0KLCT-ND; Quantity Override: 1
R154 = RES1474: Manufacturer 1: Panasonic Electronic Components; Manufacturer Part Number 1: ERJ-2RKF22R0X; Description_: RES TKF 22R 1% 1/20W SMD 0402; Dev Tools Status: Production; Temperature Coeffcient: 100ppm/C; Circuit Type: Isolated; Power: 1/10W; Owner: Mike Ragsdale; Populated: YES; MCHP-ID: RES1474; Revision: 1; Symbol: Resistor; Status: MCL Design; ComponentLink1Description: SVN Datasheet; ComponentLink2Description: Local Datasheet; ComponentLink3URL: C:\ALTIUM_WORK\00001_MCHP-CDB\Library\LibraryRefs\Resistor.SchLib; ComponentLink3Description: Open Symbol; ComponentLink4URL: C:\ALTIUM_WORK\00001_MCHP-CDB\Library\Footprints\RES_C_0402.PcbLib; ComponentLink4Description: Open Footprint; ComponentLink5Description: Open Footprint 2; ComponentLink6Description: Open Footprint 3; ComponentLink7Description: Open Footprint 4; Operating Temperature: -55C to +155C; Category: Resistor; Type: RES SMD; Composition: TKF; Supplier 1: Digi-Key; Supplier Part Number 1: P22.0LCT-ND; Quantity Override: 1
R155-R160 = RES1552: Manufacturer 1: Panasonic Electronic Components; Manufacturer Part Number 1: ERJ-2RKF33R0X; Description_: RES TKF 33R 1% 1/10W SMD 0402; Dev Tools Status: Production; Temperature Coeffcient: 100ppm/C; Power: 1/10W; Owner: Sorin Stanoaia; Populated: YES; MCHP-ID: RES1552; Revision: 1; Symbol: Resistor; Status: MCL Design; ComponentLink1Description: SVN Datasheet; ComponentLink2Description: Local Datasheet; ComponentLink3URL: C:\ALTIUM_WORK\00001_MCHP-CDB\Library\LibraryRefs\Resistor.SchLib; ComponentLink3Description: Open Symbol; ComponentLink4URL: C:\ALTIUM_WORK\00001_MCHP-CDB\Library\Footprints\RES_C_0402.PcbLib; ComponentLink4Description: Open Footprint; ComponentLink5Description: Open Footprint 2; ComponentLink6Description: Open Footprint 3; ComponentLink7Description: Open Footprint 4; Operating Temperature: -55C to +155C; Category: Resistor; Type: RES SMD; Composition: TKF; Supplier 1: Digi-Key; Supplier Part Number 1: P33.0LCT-ND; Quantity Override: 1; ComponentLink1URL: https://chn-vm-apps.microchip.com/mchprepo/parts/Datasheets/AOA0000CE2.pdf; ComponentLink2URL: C:\ALTIUM_WORK\00001_MCHP-CDB\Datasheets\AOA0000CE2.pdf
R164 = RES1474: Manufacturer 1: Panasonic Electronic Components; Manufacturer Part Number 1: ERJ-2RKF22R0X; Description_: RES TKF 22R 1% 1/20W SMD 0402; Dev Tools Status: Production; Temperature Coeffcient: 100ppm/C; Circuit Type: Isolated; Power: 1/10W; Owner: Mike Ragsdale; Populated: DNP; MCHP-ID: RES1474; Revision: 1; Symbol: Resistor; Status: MCL Design; ComponentLink1Description: SVN Datasheet; ComponentLink2Description: Local Datasheet; ComponentLink3URL: C:\ALTIUM_WORK\00001_MCHP-CDB\Library\LibraryRefs\Resistor.SchLib; ComponentLink3Description: Open Symbol; ComponentLink4URL: C:\ALTIUM_WORK\00001_MCHP-CDB\Library\Footprints\RES_C_0402.PcbLib; ComponentLink4Description: Open Footprint; ComponentLink5Description: Open Footprint 2; ComponentLink6Description: Open Footprint 3; ComponentLink7Description: Open Footprint 4; Operating Temperature: -55C to +155C; Category: Resistor; Type: RES SMD; Composition: TKF; Supplier 1: Digi-Key; Supplier Part Number 1: P22.0LCT-ND; Quantity Override: 1
R165 R167 R168 = RES2693: Manufacturer 1: Bourns Inc.; Manufacturer Part Number 1: CR0402-J/-000GLF; Description_: RES TKF 0R 1/16W SMD 0402; Dev Tools Status: Design; Power: 1/16W; Populated: DNP; Owner: Dragos Danaila; Voltage: 50V; Temperature Coeffcient: 100ppm/C; Current: 1A; MCHP-ID: RES2693; Revision: 1; Symbol: Resistor; Status: MCL Design; ComponentLink1URL: https://chn-vm-apps.microchip.com/mchprepo/parts/Datasheets/crxxxxx.pdf; ComponentLink1Description: SVN Datasheet; ComponentLink2URL: C:\ALTIUM_WORK\00001_MCHP-CDB\Datasheets\crxxxxx.pdf; ComponentLink2Description: Local Datasheet; ComponentLink3URL: C:\ALTIUM_WORK\00001_MCHP-CDB\Library\LibraryRefs\Resistor.SchLib; ComponentLink3Description: Open Symbol; ComponentLink4URL: C:\ALTIUM_WORK\00001_MCHP-CDB\Library\Footprints\RES_C_0402.PcbLib; ComponentLink4Description: Open Footprint; ComponentLink5Description: Open Footprint 2; ComponentLink6Description: Open Footprint 3; ComponentLink7Description: Open Footprint 4; Operating Temperature: -55C to +155C; Category: Resistor; Type: RES SMD; Composition: TKF; Supplier 1: Digikey; Supplier Part Number 1: CR0402-J/-000GLFTR-ND; Quantity Override: 1
R166 = RES2693: Manufacturer 1: Bourns Inc.; Manufacturer Part Number 1: CR0402-J/-000GLF; Description_: RES TKF 0R 1/16W SMD 0402; Dev Tools Status: Design; Power: 1/16W; Populated: YES; Owner: Dragos Danaila; Voltage: 50V; Temperature Coeffcient: 100ppm/C; Current: 1A; MCHP-ID: RES2693; Revision: 1; Symbol: Resistor; Status: MCL Design; ComponentLink1URL: https://chn-vm-apps.microchip.com/mchprepo/parts/Datasheets/crxxxxx.pdf; ComponentLink1Description: SVN Datasheet; ComponentLink2URL: C:\ALTIUM_WORK\00001_MCHP-CDB\Datasheets\crxxxxx.pdf; ComponentLink2Description: Local Datasheet; ComponentLink3URL: C:\ALTIUM_WORK\00001_MCHP-CDB\Library\LibraryRefs\Resistor.SchLib; ComponentLink3Description: Open Symbol; ComponentLink4URL: C:\ALTIUM_WORK\00001_MCHP-CDB\Library\Footprints\RES_C_0402.PcbLib; ComponentLink4Description: Open Footprint; ComponentLink5Description: Open Footprint 2; ComponentLink6Description: Open Footprint 3; ComponentLink7Description: Open Footprint 4; Operating Temperature: -55C to +155C; Category: Resistor; Type: RES SMD; Composition: TKF; Supplier 1: Digikey; Supplier Part Number 1: CR0402-J/-000GLFTR-ND; Quantity Override: 1
R169 = RES2380: Manufacturer 1: Panasonic Electronic Components; Manufacturer Part Number 1: ERJ-2RKF6041X; Description_: RES TKF 6.04k 1% 1/10W AEC-Q200 SMD 0402; Dev Tools Status: Design; Power: 1/10W; Owner: Steve Dziaba; Populated: YES; Circuit Type: Isolated; MCHP-ID: RES2380; Revision: A; Symbol: Resistor; Status: MCL Design; ComponentLink1URL: https://chn-vm-apps.microchip.com/mchprepo/parts/Datasheets/ERJ-2RKF6041X.pdf; ComponentLink1Description: SVN Datasheet; ComponentLink2URL: C:\ALTIUM_WORK\00001_MCHP-CDB\Datasheets\ERJ-2RKF6041X.pdf; ComponentLink2Description: Local Datasheet; ComponentLink3URL: C:\ALTIUM_WORK\00001_MCHP-CDB\Library\LibraryRefs\Resistor.SchLib; ComponentLink3Description: Open Symbol; ComponentLink4URL: C:\ALTIUM_WORK\00001_MCHP-CDB\Library\Footprints\RES_C_0402.PcbLib; ComponentLink4Description: Open Footprint; ComponentLink5Description: Open Footprint 2; ComponentLink6Description: Open Footprint 3; ComponentLink7Description: Open Footprint 4; Category: Resistor; Type: RES SMD; Composition: TKF; Supplier 1: Digi-Key; Supplier Part Number 1: P6.04KLCT-ND; Quantity Override: 1; Manufacturer 2: KOA Speer; Manufacturer Part Number 2: RK73H1ETTP6041F; Supplier 2: Digi-Key; Supplier Part Number 2: 2019-RK73H1ETTP6041FCT-ND
R170 = RSMT0737: Manufacturer 1: Panasonic; Manufacturer Part Number 1: ERJ-2GEJ104X; Description_: RES TKF 100k 5% 1/10W SMD 0402; Dev Tools Status: Production; Temperature Coeffcient: 200ppm/C; Power: 1/10W; Populated: Yes; Voltage: 50V; MCHP-ID: RSMT0737; Revision: 1; Symbol: Resistor; Status: MCL Design; ComponentLink1URL: https://chn-vm-apps.microchip.com/mchprepo/parts/Datasheets/AOA0000CE1.pdf; ComponentLink1Description: SVN Datasheet; ComponentLink2URL: C:\ALTIUM_WORK\00001_MCHP-CDB\Datasheets\AOA0000CE1.pdf; ComponentLink2Description: Local Datasheet; ComponentLink3URL: C:\ALTIUM_WORK\00001_MCHP-CDB\Library\LibraryRefs\Resistor.SchLib; ComponentLink3Description: Open Symbol; ComponentLink4URL: C:\ALTIUM_WORK\00001_MCHP-CDB\Library\Footprints\RES_C_0402.PcbLib; ComponentLink4Description: Open Footprint; ComponentLink5Description: Open Footprint 2; ComponentLink6Description: Open Footprint 3; ComponentLink7Description: Open Footprint 4; Category: Resistor; Type: RES SMD; Composition: TKF; Supplier 1: Digi-Key; Supplier Part Number 1: P100KJCT-ND; Quantity Override: 1; Operating Temperature: -55C to +155C; Manufacturer 2: Stackpole Electronics Inc; Manufacturer Part Number 2: RMCF0402JT100K; Supplier 2: Digi-Key; Supplier Part Number 2: RMCF0402JT100KCT-ND
R171 = RSMT1294: Manufacturer 1: Panasonic Electronic Components; Manufacturer Part Number 1: ERJ-PA2F51R0X; Description_: RES TKF 51R 1% 1/5W SMD 0402; Dev Tools Status: Design; Voltage: 50V; Temperature Coeffcient: 100ppm/C; Power: 1/5W; Owner: Dragos Danaila; Populated: YES; MCHP-ID: RSMT1294; Revision: 1; Symbol: Resistor; Status: MCL Design; ComponentLink1URL: https://chn-vm-apps.microchip.com/mchprepo/parts/Datasheets/AOA0000C331.pdf; ComponentLink1Description: SVN Datasheet; ComponentLink2URL: C:\ALTIUM_WORK\00001_MCHP-CDB\Datasheets\AOA0000C331.pdf; ComponentLink2Description: Local Datasheet; ComponentLink3URL: C:\ALTIUM_WORK\00001_MCHP-CDB\Library\LibraryRefs\Resistor.SchLib; ComponentLink3Description: Open Symbol; ComponentLink4URL: C:\ALTIUM_WORK\00001_MCHP-CDB\Library\Footprints\RES_C_0402.PcbLib; ComponentLink4Description: Open Footprint; ComponentLink5Description: Open Footprint 2; ComponentLink6Description: Open Footprint 3; ComponentLink7Description: Open Footprint 4; Operating Temperature: -55C to +155C; Category: Resistor; Type: RES SMD; Composition: TKF; Supplier 1: Digikey; Supplier Part Number 1: P124491CT-ND; Quantity Override: 1
TP29 = CON1759: Test Point; Value: TP PAD PCB 1mm; Description_: CON TP PAD PCB 1mm SMD; Dev Tools Status: Design; Owner: Cristian Papuc; Populated: YES; MCHP-ID: CON1759; Revision: A; Symbol: Test Point No BOM; Status: MCL Design; ComponentLink1Description: SVN Datasheet; ComponentLink2Description: Local Datasheet; ComponentLink3URL: C:\ALTIUM_WORK\00001_MCHP-CDB\Library\LibraryRefs\Test Point No BOM.SchLib; ComponentLink3Description: Open Symbol; ComponentLink4URL: C:\ALTIUM_WORK\00001_MCHP-CDB\Library\Footprints\TP_1mm_SMD.PcbLib; ComponentLink4Description: Open Footprint; ComponentLink5Description: Open Footprint 2; ComponentLink6Description: Open Footprint 3; ComponentLink7Description: Open Footprint 4; Type: Test Point; Category: Connector; Quantity Override: 1
U14 = MIC8258: Manufacturer 1: Microchip Technology; Description_: MCHP INTERFACE KSZ9131RNX 10/100/1000BASE-T QFN-48; Dev Tools Status: Production; Owner: Sam Charles; Populated: YES; MCHP-ID: MIC8258; Value: KSZ9131RN; Symbol: KSZ9131RNX QFN-48; Type: Ethernet; Status: MCL Design; Revision: 1; Category: MCHP-Interface; ComponentLink1Description: SVN Datasheet; ComponentLink2Description: Local Datasheet; ComponentLink3URL: C:\ALTIUM_WORK\00001_MCHP-CDB\Library\LibraryRefs\KSZ9131RNX QFN-48.SchLib; ComponentLink3Description: Open Symbol; ComponentLink4URL: C:\ALTIUM_WORK\00001_MCHP-CDB\Library\Footprints\QFN-48_7x7_EP5.1x5.1.PcbLib; ComponentLink4Description: Open Footprint; ComponentLink5Description: Open Footprint 2; ComponentLink6Description: Open Footprint 3; ComponentLink7Description: Open Footprint 4; Supplier 1: Microchip Technology; Supplier Part Number 1: kSZ9131RNXC; Quantity Override: 1
Y5 = OSC1159: Crystal; Manufacturer 1: ECS Inc.; Description_: CRYSTAL 25MHz 20pF SMD L3.2W2.5H0.8; Dev Tools Status: Design; Owner: Ciprian Abramov; Tolerance: 10ppm; Load Capacitance: 20pF; Populated: DNP; MCHP-ID: OSC1159; Revision: A; Symbol: Crystal 4 pins 1-3; Status: MCL Design; ComponentLink1URL: https://chn-vm-apps.microchip.com/mchprepo/parts/Datasheets/ecx-32.pdf; ComponentLink1Description: SVN Datasheet; ComponentLink2URL: C:\ALTIUM_WORK\00001_MCHP-CDB\Datasheets\ecx-32.pdf; ComponentLink2Description: Local Datasheet; ComponentLink3URL: C:\ALTIUM_WORK\00001_MCHP-CDB\Library\LibraryRefs\Crystal 4 pins 1-3.SchLib; ComponentLink3Description: Open Symbol; ComponentLink4URL: C:\ALTIUM_WORK\00001_MCHP-CDB\Library\Footprints\CRYSTAL_L3.2W2.5H0.8.PcbLib; ComponentLink4Description: Open Footprint; ComponentLink5Description: Open Footprint 2; ComponentLink6Description: Open Footprint 3; ComponentLink7Description: Open Footprint 4; Operating Temperature: -20C to +70C; Package: L3.2W2.5H0.8; Type: Crystal; Category: Crystal/Oscillator; Supplier 1: Digi-Key; Supplier Part Number 1: XC1817CT-ND; Quantity Override: 1
Y6 = MIC8282: Manufacturer 1: Microchip Technology; Description_: MCHP CLOCK OSCILLATOR SINGLE 25MHz DSC1001DI5-025.0000 DFN-4; Dev Tools Status: Design; Value: 25MHz; Owner: Ciprian Abramov; Populated: YES; MCHP-ID: MIC8282; Revision: A; Symbol: DSC10xx DFN-4; Status: MCL Design; ComponentLink1Description: SVN Datasheet; ComponentLink2Description: Local Datasheet; ComponentLink3URL: C:\ALTIUM_WORK\00001_MCHP-CDB\Library\LibraryRefs\DSC10xx DFN-4.SchLib; ComponentLink3Description: Open Symbol; ComponentLink4URL: C:\ALTIUM_WORK\00001_MCHP-CDB\Library\Footprints\DFN-4_2.5x2.PcbLib; ComponentLink4Description: Open Footprint; ComponentLink5Description: Open Footprint 2; ComponentLink6Description: Open Footprint 3; ComponentLink7Description: Open Footprint 4; Category: MCHP-Clock/Timing; Type: Oscillator; Supplier 1: Digi-Key; Supplier Part Number 1: 576-4982-5-ND; Quantity Override: 1